# Altium schematic sheet Power.SchDoc
size A4
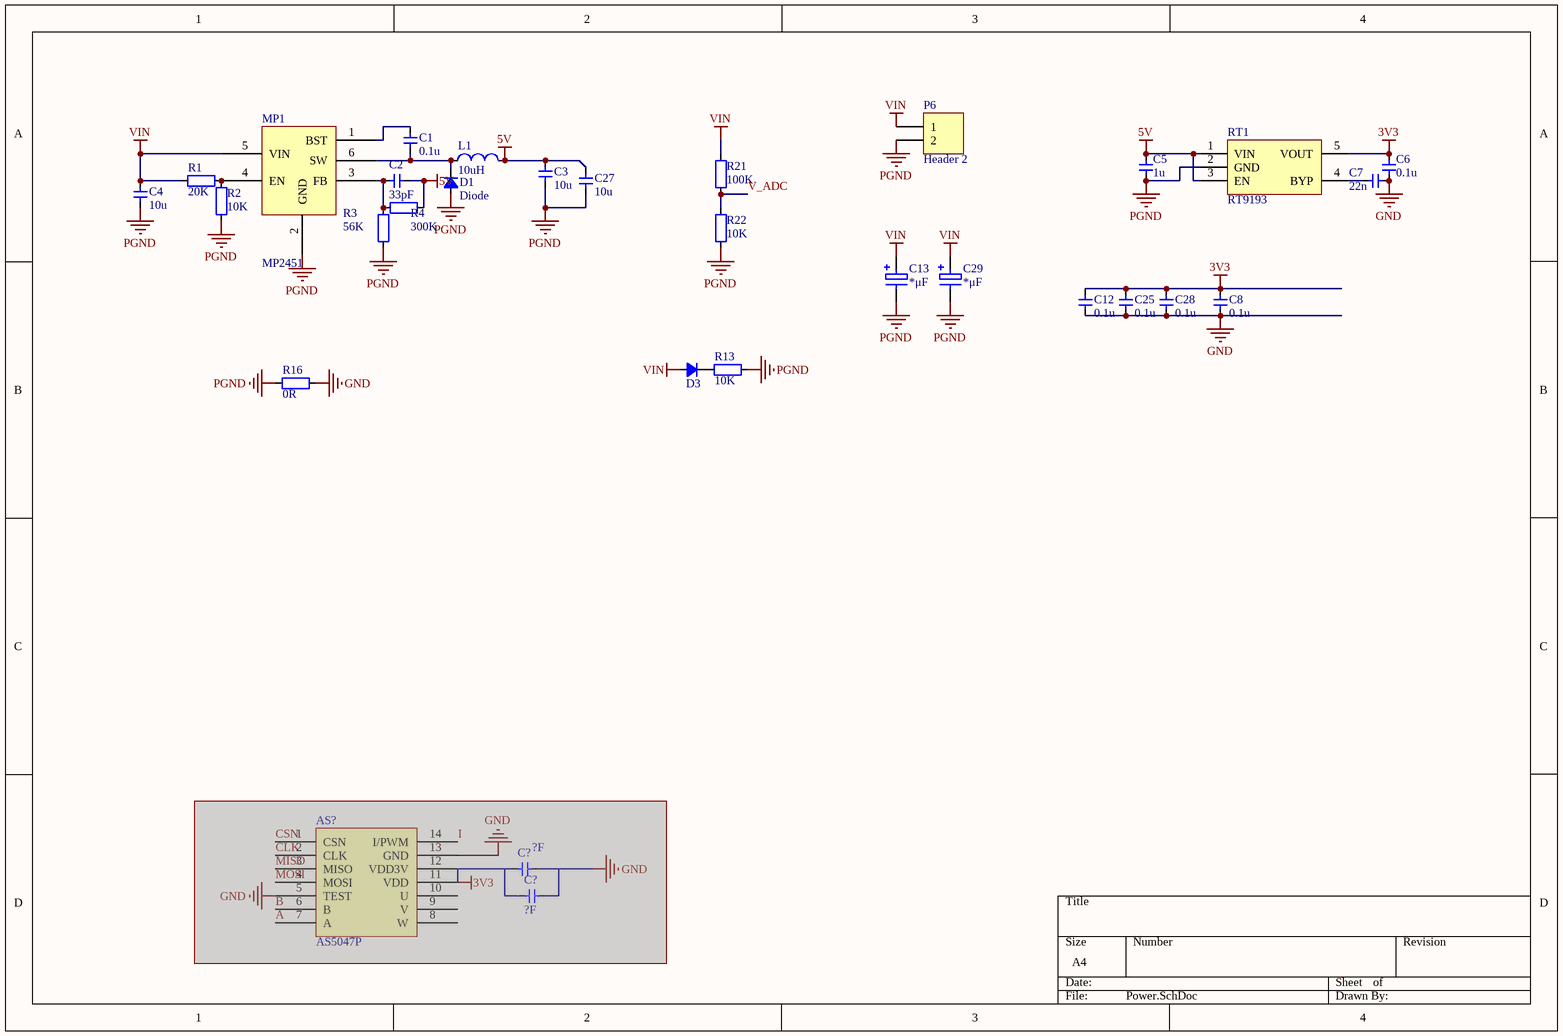
[diagram p0: Power.SchDoc]

## Parts
(Parts that share a designator on the sheet are numbered #1, #2 ... from top to bottom, then left to right.)
AS?  AS5047P  [AS5047P]  (masked out: inside a compile mask, not in the netlist)
C1  value 0.1u  [CAP_0603]  (hidden comment: Cap_0603)
C2  value 33pF  [CAP_0603]  (hidden comment: Cap_0603)
C3  value 10u  [CAP_0805]  (hidden comment: Cap_0805)
C4  value 10u  [CAP_0805]  (hidden comment: Cap_0805)
C5  value 1u  [CAP_0603]  (hidden comment: Cap_0603)
C6  value 0.1u  [CAP_0603]  (hidden comment: Cap_0603)
C7  value 22n  [CAP_0603]  (hidden comment: Cap_0603)
C8  value 0.1u  [CAP_0603]  (hidden comment: Cap_0603)
C12  value 0.1u  [CAP_0603]  (hidden comment: Cap_0603)
C13  *μF  [CAP-ELE-PIN150/DIA320]
C25  value 0.1u  [CAP_0603]  (hidden comment: Cap_0603)
C27  value 10u  [CAP_0805]  (hidden comment: Cap_0805)
C28  value 0.1u  [CAP_0603]  (hidden comment: Cap_0603)
C29  *μF  [CAP-ELE-PIN150/DIA320]
C?#1  value ?F  [CAP_0603]  (hidden comment: Cap_0603)  (masked out: inside a compile mask, not in the netlist)
C?#2  value ?F  [CAP_0603]  (hidden comment: Cap_0603)  (masked out: inside a compile mask, not in the netlist)
D1  Diode  [LED_0805_RED]
D3  D_0805  [LED_0805_YELLOW]  (value not drawn)
L1  value 10uH  [IND_CD52]  (hidden comment: Ind_CD32)
MP1  MP2451  [SOT23-6]
P6  Header 2  [power]
R1  value 20K  [RES_0603]  (hidden comment: Res_0603)
R2  value 10K  [RES_0603]  (hidden comment: Res_0603)
R3  value 56K  [RES_0603]  (hidden comment: Res_0603)
R4  value 300K  [RES_0603]  (hidden comment: Res_0603)
R13  value 10K  [RES_0603]  (hidden comment: Res_0603)
R16  value 0R  [RES_0603]  (hidden comment: Res_0603)
R21  value 100K  [RES_0603]  (hidden comment: Res_0603)
R22  value 10K  [RES_0603]  (hidden comment: Res_0603)
RT1  RT9193  [SOT23-5]

## Nets
3V3: C6.2 C8.2 C12.2 C25.2 C28.2 RT1.5(VOUT)
5V: C2.1 C3.2 C5.2 C27.2 L1.2 R4.2 RT1.1(VIN) RT1.3(EN)
GND: C6.1 C7.1 C8.1 C12.1 C25.1 C28.1 R16.2
PGND: C3.1 C4.1 C5.1 C13.2 C27.1 C29.2 D1.1(A) MP1.2(GND) P6.2 R2.2 R3.2 R13.2 R16.1 R22.2 RT1.2(GND)
VIN: C4.2 C13.1 C29.1 D3.1(A) MP1.5(VIN) P6.1 R1.1 R21.1
V_ADC: R21.2 R22.1
NetC1_1: C1.1 D1.2(K) L1.1 MP1.6(SW)
NetC1_2: C1.2 MP1.1(BST)
NetC2_2: C2.2 MP1.3(FB) R3.1 R4.1
NetC7_2: C7.2 RT1.4(BYP)
NetD3_2: D3.2(K) R13.1
NetMP1_4: MP1.4(EN) R1.2 R2.1

## Library data of the parts
C1 C2 C5-C8 C12 C25 C28 C?#1 C?#2 = Cap_0603: Capacitor
C3 C4 C27 = Cap_0805: Capacitor
C13 C29 = CAP-ELE: 电解电容; Published: 8-Jun-2000; LatestRevisionDate: 17-Jul-2002; LatestRevisionNote: Re-released for DXP Platform.; PackageReference: RB7.6-15; Publisher: Altium Limited; PackageDescription: Polarized Capacitor (Radial); 2 Leads; Value: *μF
L1 = Ind_CD32: Inductor
P6 = Header 2: Header, 2-Pin; LatestRevisionDate: 17-Jul-2002; LatestRevisionNote: Re-released for DXP Platform.; Publisher: Altium Limited
R1-R4 R13 R16 R21 R22 = Res_0603: Resistor
RT1 = RT9193: Power